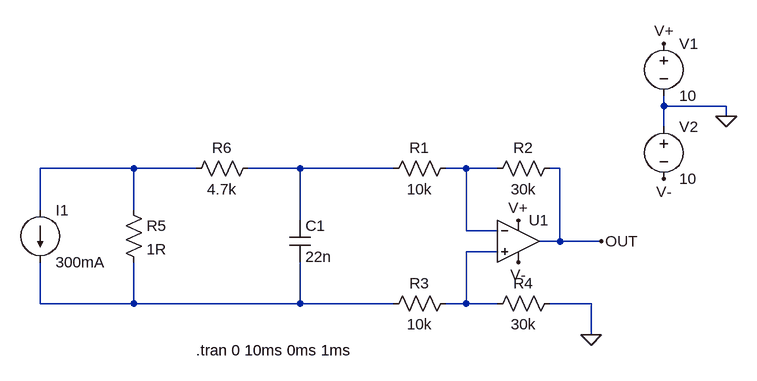
[diagram p0: schematic differential_amp.asc]
differential_amp.asc, the LTspice schematic file:
Version 4
SHEET 1 880 680
WIRE 416 -32 416 -48
WIRE 512 -32 416 -32
WIRE 512 -16 512 -32
WIRE 416 0 416 -32
WIRE -400 64 -544 64
WIRE -304 64 -400 64
WIRE -144 64 -224 64
WIRE 0 64 -144 64
WIRE 112 64 80 64
WIRE 160 64 112 64
WIRE 256 64 240 64
WIRE -544 128 -544 64
WIRE -400 128 -400 64
WIRE -144 144 -144 64
WIRE 112 160 112 64
WIRE 160 160 112 160
WIRE 256 176 256 64
WIRE 256 176 224 176
WIRE 320 176 256 176
WIRE 160 192 112 192
WIRE -544 272 -544 208
WIRE -400 272 -400 208
WIRE -400 272 -544 272
WIRE -144 272 -144 208
WIRE -144 272 -400 272
WIRE 0 272 -144 272
WIRE 112 272 112 192
WIRE 112 272 80 272
WIRE 160 272 112 272
WIRE 304 272 240 272
WIRE 304 320 304 272
FLAG 304 320 0
FLAG 320 176 OUT
FLAG 192 144 V+
FLAG 192 208 V-
FLAG 512 -16 0
FLAG 416 -128 V+
FLAG 416 80 V-
SYMBOL res 96 48 R90
WINDOW 0 0 56 VBottom 2
WINDOW 3 32 56 VTop 2
SYMATTR InstName R1
SYMATTR Value 10k
SYMBOL res 256 48 R90
WINDOW 0 0 56 VBottom 2
WINDOW 3 32 56 VTop 2
SYMATTR InstName R2
SYMATTR Value 30k
SYMBOL res 96 256 R90
WINDOW 0 0 56 VBottom 2
WINDOW 3 32 56 VTop 2
SYMATTR InstName R3
SYMATTR Value 10k
SYMBOL res 256 256 R90
WINDOW 0 0 56 VBottom 2
WINDOW 3 32 56 VTop 2
SYMATTR InstName R4
SYMATTR Value 30k
SYMBOL current -544 128 R0
WINDOW 123 0 0 Left 2
WINDOW 39 0 0 Left 2
SYMATTR InstName I1
SYMATTR Value 300mA
SYMBOL res -416 112 R0
SYMATTR InstName R5
SYMATTR Value 1R
SYMBOL Opamps\\UniversalOpamp2 192 176 R0
SYMATTR InstName U1
SYMBOL voltage 416 -144 R0
WINDOW 123 0 0 Left 2
WINDOW 39 0 0 Left 2
SYMATTR InstName V1
SYMATTR Value 10
SYMBOL voltage 416 -16 R0
WINDOW 123 0 0 Left 2
WINDOW 39 0 0 Left 2
SYMATTR InstName V2
SYMATTR Value 10
SYMBOL res -208 48 R90
WINDOW 0 0 56 VBottom 2
WINDOW 3 32 56 VTop 2
SYMATTR InstName R6
SYMATTR Value 4.7k
SYMBOL cap -160 144 R0
SYMATTR InstName C1
SYMATTR Value 22n
TEXT -304 344 Left 2 !.tran 0 10ms 0ms 1ms

The netlist it stands for:
* differential_amp.asc
R1 N003 N002 10k
R2 OUT N003 30k
R3 N004 N005 10k
R4 0 N004 30k
I1 N001 N005 300mA
R5 N001 N005 1R
XU1 N004 N003 V+ V- OUT level.2 Avol=1Meg GBW=10Meg Slew=10Meg ilimit=25m rail=0 Vos=0 phimargin=45 en=0 enk=0 in=0 ink=0 Rin=500Meg  ; pins IN+ IN- V+ V- OUT
V1 V+ 0 10
V2 0 V- 10
R6 N002 N001 4.7k
C1 N002 N005 22n
.tran 0 10ms 0ms 1ms
.lib UniversalOpamps2.sub
.backanno
.end